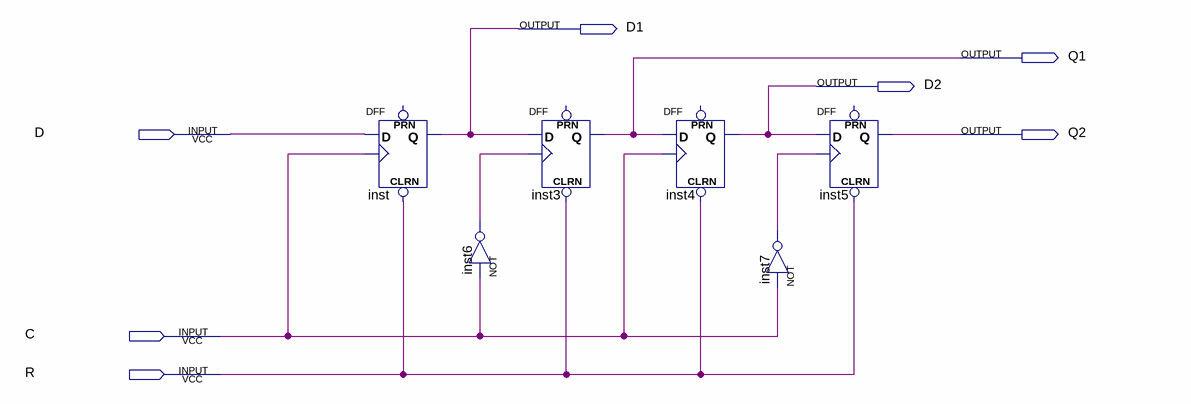
[diagram p0: schematic sheet]
// Quartus schematic Two-digit_single-stroke_shift_register.bdf as structural Verilog: 6 symbols, 7 pins
module \Two-digit_single-stroke_shift_register  (
  input  D,
  input  C,
  input  R,
  output D1,
  output Q1,
  output D2,
  output Q2
);

  wire inst6_out, inst7_out;

  DFF inst (.CLRN(R), .CLK(C), .D(D), .Q(D1));  // open: PRN
  not inst6 (inst6_out, C);
  DFF inst3 (.CLRN(R), .CLK(inst6_out), .D(D1), .Q(Q1));  // open: PRN
  DFF inst4 (.CLRN(R), .CLK(C), .D(Q1), .Q(D2));  // open: PRN
  not inst7 (inst7_out, C);
  DFF inst5 (.CLRN(R), .CLK(inst7_out), .D(D2), .Q(Q2));  // open: PRN
endmodule
